# Altium schematic sheet Sheet2.SchDoc
size A; SheetNumber: 4; SheetTotal: 4
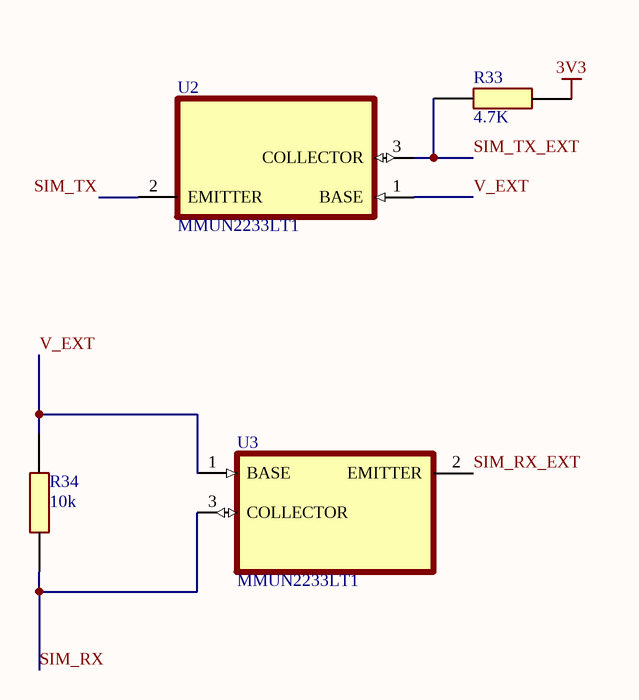
[diagram p0: Sheet2.SchDoc]

## Parts
R33  4.7K  [RESC1608X55N]
R34  10k  [RESC2012X60N]
U2  MMUN2233LT1  [SOT95P237X111-3N]
U3  MMUN2233LT1  [SOT95P237X111-3N]

## Nets
3V3: R33.2
SIM_RX: R34.1 U3.3(COLLECTOR)
SIM_RX_EXT: U3.2(EMITTER)
SIM_TX: U2.2(EMITTER)
SIM_TX_EXT: R33.1 U2.3(COLLECTOR)
V_EXT: R34.2 U2.1(BASE) U3.1(BASE)

## Library data of the parts
R33 = RC0603FR-074K7L: Resistor; Manufacturer_Name: KEMET; Datasheet Link: http://www.yageo.com/documents/recent/PYu-RC0603_51_RoHS_L_v5.pdf; Height: 0.55mm; Manufacturer_Part_Number: RC0603FR-074K7L; Mouser Part Number: 603-RC0603FR-074K7L; Mouser Price/Stock: https://www.mouser.co.uk/ProductDetail/YAGEO/RC0603FR-074K7L?qs=gt6vzsuosg37y0l7Vt36bQ%3D%3D; Arrow Part Number: RC0603FR-074K7L; Arrow Price/Stock: https://www.arrow.com/en/products/rc0603fr-074k7l/yageo?region=europe
R34 = CR0805-FX-1002ELF: Resistor; Manufacturer_Name: Bourns; Datasheet Link: https://www.bourns.com/pdfs/chpreztr.pdf; Height: 0.6mm; Manufacturer_Part_Number: CR0805-FX-1002ELF; Mouser Part Number: 652-CR0805FX-1002ELF; Mouser Price/Stock: https://www.mouser.co.uk/ProductDetail/Bourns/CR0805-FX-1002ELF?qs=tknLyCMIRbPr%252BDD0s0nG9g%3D%3D; Arrow Part Number: CR0805-FX-1002ELF; Arrow Price/Stock: https://www.arrow.com/en/products/cr0805-fx-1002elf/bourns?region=nac
U2 U3 = MMUN2233LT1: Pre-Biased Bipolar Transistor (BJT) NPN - Pre-Biased 50V 100mA 246mW Surface Mount SOT-23-3 (TO-236); MF: ON Semiconductor; SnapEDA_Link: https://www.snapeda.com/parts/MMUN2233LT1/Onsemi/view-part/?ref=snap; Package: SOT-23-3 ON Semiconductor; Value: *; MP: MMUN2233LT1; Check_prices: https://www.snapeda.com/parts/MMUN2233LT1/Onsemi/view-part/?ref=eda